# EAGLE schematic can4vscp_eth_rev_A (EAGLE 6.6.0)
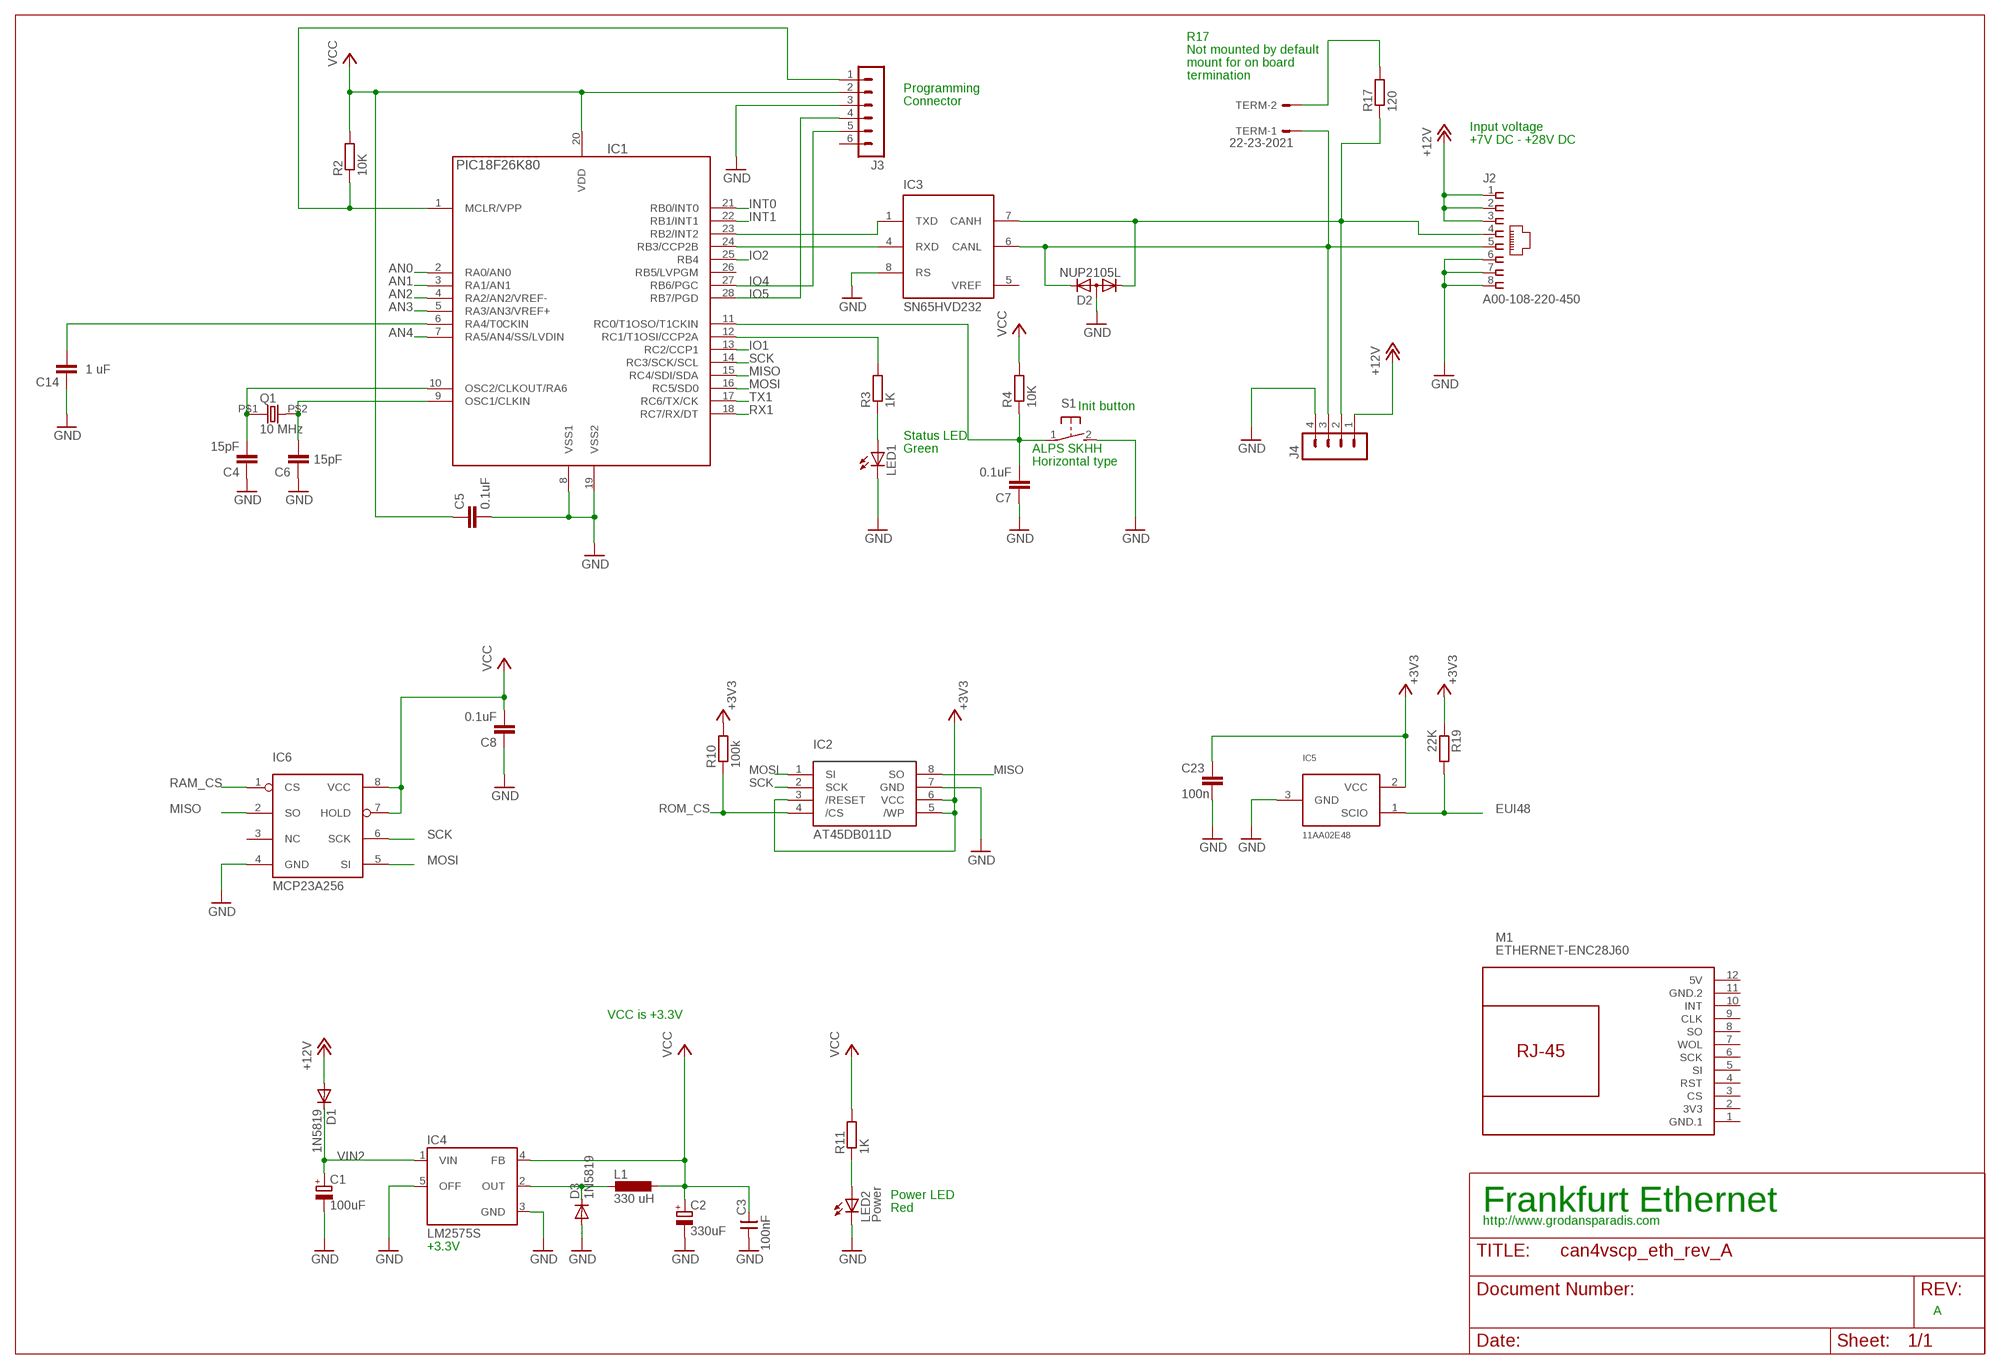
[diagram p0: schematic, sheet 1]

## Parts
C1  100uF  CPOL-EUD  [PANASONIC_D]
C2  330uF  CPOL-EUD  [PANASONIC_D]
C3  100nF  CNP-0805  [0805]
C4  15pF  C-EUC0805  [C0805]
C5  0.1uF  C-EUC0805  [C0805]
C6  15pF  C-EUC0805  [C0805]
C7  0.1uF  C-EUC0805  [C0805]
C8  0.1uF  C-EUC0805  [C0805]
C14  1 uF  C-EUC0805  [C0805]
C23  100n  C-EUC0805  [C0805]
D1  1N5819  DIODE-SOD123  [SOD123]
D2  NUP2105L  DIODE-2CA|ACSOT23  [SOT23]
D3  1N5819  DIODE-SOD123  [SOD123]
IC1  PIC18F26K80  PIC18LF252-I/SO  [SO28]
IC2  AT45DB011D  AT45DB011DSOP8W  [SOP8W]
IC3  SN65HVD232  MCP2551SN  [SO-08]
IC4  LM2575S  [TO263-5]
IC5  11AA02E48  [SOT23]
IC6  MCP23A256  [SO-8]
J2  A00-108-220-450  [RJ-45]
J3  MA06-1  [MA06-1]
J4  MA04-1  [MA04-1]
L1  330 uH  DO3316P  [DO3316P]
LED1  LEDCHIP-LED0805  [CHIP-LED0805]
LED2  Power  LEDCHIP-LED0805  [CHIP-LED0805]
M1  ETHERNET-ENC28J60  [ETHERNET-ENC28J60]
Q1  10 MHz  HC-49S  [9C]
R2  10K  R-EU_R0805  [R0805]
R3  1K  R-EU_R0805  [R0805]
R4  10K  R-EU_R0805  [R0805]
R10  100k  R-EU_M0805  [M0805]
R11  1K  R-EU_R0805  [R0805]
R17  120  R-EU_R0805  [R0805]
R19  22K  R-EU_M0805  [M0805]
S1  31-XX  [B3F-31XX]
TERM  22-23-2021  [22-23-2021]

## Nets
+3V3: C23.1 IC2.3(/RESET) IC2.5(/WP) IC2.6(VCC) IC5.2(VCC) R10.2 R19.1
+12V: D1.A J2.1 J2.2 J2.3 J4.1
AN0: IC1.2(RA0/AN0)
AN1: IC1.3(RA1/AN1)
AN2: IC1.4(RA2/AN2/VREF-)
AN3: IC1.5(RA3/AN3/VREF+)
AN4: IC1.7(RA5/AN4/SS/LVDIN)
CANL: D2.2(K2) IC3.6(CANL) J2.5 J4.3 TERM.1
EUI48: IC5.1(SCIO) R19.2
GND: C1.- C2.- C3.1 C4.1 C5.2 C6.1 C7.1 C8.1 C14.1 C23.2 D2.3(A) D3.A IC1.8(VSS1) IC1.19(VSS2) IC2.7(GND) IC3.8(RS) IC4.3(GND) IC4.5(OFF) IC5.3(GND) IC6.4(GND) J2.6 J2.7 J2.8 J3.3 J4.4 LED1.C LED2.C S1.2(S)
INT0: IC1.21(RB0/INT0)
INT1: IC1.22(RB1/INT1)
IO1: IC1.13(RC2/CCP1)
IO2: IC1.25(RB4)
IO4: IC1.27(RB6/PGC) J3.5
IO5: IC1.28(RB7/PGD) J3.4
MISO: IC1.15(RC4/SDI/SDA) IC2.8(SO) IC6.2(SO)
MOSI: IC1.16(RC5/SD0) IC2.1(SI) IC6.5(SI)
N$1: D3.C IC4.2(OUT) L1.1
N$2: C4.2 IC1.10(OSC2/CLKOUT/RA6) Q1.P$1
N$3: C14.2 IC1.6(RA4/T0CKIN)
N$4: IC1.12(RC1/T1OSI/CCP2A) R3.2
N$5: LED1.A R3.1
N$6: C7.2 IC1.11(RC0/T1OSO/T1CKIN) R4.1 S1.1(P)
N$7: C6.2 IC1.9(OSC1/CLKIN) Q1.P$2
N$11: R17.2 TERM.2
N$20: LED2.A R11.1
N$22: D2.1(K1) IC3.7(CANH) J2.4 J4.2 R17.1
RAM_CS: IC6.1(CS)
RESET: IC1.1(MCLR/VPP) J3.1 R2.1
ROM_CS: IC2.4(/CS) R10.1
RX1: IC1.18(RC7/RX/DT)
RXCAN: IC1.24(RB3/CCP2B) IC3.4(RXD)
SCK: IC1.14(RC3/SCK/SCL) IC2.2(SCK) IC6.6(SCK)
TX1: IC1.17(RC6/TX/CK)
TXCAN: IC1.23(RB2/INT2) IC3.1(TXD)
VCC: C2.+ C3.2 C5.1 C8.2 IC1.20(VDD) IC4.4(FB) IC6.7(HOLD) IC6.8(VCC) J3.2 L1.2 R2.2 R4.2 R11.2
VIN2: C1.+ D1.C IC4.1(VIN)
Unconnected: IC1.26(RB5/LVPGM) IC6.3(NC) J3.6 M1.3(CS) M1.4(RST) M1.5(SI) M1.6(SCK) M1.7(WOL) M1.8(SO) M1.9(CLK) M1.10(INT)

## Notes on the sheet
- R17
- Not mounted by default
- mount for on board
- termination
- Programming
- Connector
- Input voltage
- +7V DC - +28V DC
- Init button
- Status LED
- Green | ALPS SKHH
- Horizontal type
- VCC is +3.3V
- Power LED
- Red | Frankfurt Ethernet
- http://www.grodansparadis.com
- +3.3V
- A

## Power pins joined to a net without a drawn wire
3V3: M1.2(3V3)
5V: M1.12(5V)
GND.1: M1.1(GND.1)
GND.2: M1.11(GND.2)
VDD: IC3.3(VDD)
VREF: IC3.5(VREF)
VSS: IC3.2(VSS)

## Library data of the parts
C1 C2 = rcl:CPOL-EU: POLARIZED CAPACITOR, European symbol
C3 = cap-master:CNP-: NON-POLARIZED CAP
C4-C8 C14 C23 = rcl:C-EU: CAPACITOR, European symbol
D1 D3 = diode:DIODE-: DIODE
D2 = diode:DIODE-2CA|AC: Dual DIODE Cathode-Anode|Anode-Cathode
IC1 = pic_olin:PIC18*F252-?: 18F252, 28 pin, 32Kb prog, 1536 data, 256 EEPROM
IC2 = snow:AT45DB011D
IC3 = microchip_can:MCP2551: High Speed CAN tranceiver
IC4 = v-reg-3:LM2575: National Semiconductor <http://www.national.com> 1.0A "Simple Switcher"(c) 52kHz, Vout 1.23-37V (HV: 57V), Vin 40V (HV: 60V), 50µA standby current
IC5 = snow:11AA02E48
IC6 = vscpcan:MCP23A256
J2 = vscpcan:A00-108-220-450
J3 = con-lstb:MA06-1: PIN HEADER; OC_FARNELL: unknown; OC_NEWARK: unknown
J4 = con-lstb:MA04-1: PIN HEADER; OC_FARNELL: unknown; OC_NEWARK: unknown
L1 = inductor-coilcraft:DO3316P: COILCRAFT; OC_FARNELL: unknown; OC_NEWARK: unknown
LED1 LED2 = led:LED: LED OSRAM: - CHIPLED LG R971, LG N971, LY N971, LG Q971, LY Q971, LO R971, LY R971 LH N974, LH R974 LS Q976, LO Q976, LY Q976 LO Q996 - Hyper CHIPLED LW Q18S LB Q993, LB Q99A, LB R99A - SideLED LS A670, LO A670, LY A670, LG A670, LP A670 LB A673, LV A673, LT A673, LW A673 LH A674 LY A675 LS A676, LA A676, LO A676, LY A676, LW A676 LS A679, LY A679, LG A679 - Hyper Micro SIDELED® LS Y876, LA Y876, LO Y876, LY Y876 LT Y87S - SmartLED LW L88C, LW L88S LB L89C, LB L89S, LG L890 LS L89K, LO L89K, LY L89K LS L896, LA L896, LO L896, LY L896 - TOPLED LS T670, LO T670, LY T670, LG T670, LP T670 LSG T670, LSP T670, LSY T670, LOP T670, LYG T670 LG T671, LOG T671, LSG T671 LB T673, LV T673, LT T673, LW T673 LH T674 LS T676, LA T676, LO T676, LY T676, LB T676, LH T676, LSB T676, LW T676 LB T67C, LV T67C, LT T67C, LS T67K, LO T67K, LY T67K, LW E67C LS E67B, LA E67B, LO E67B, LY E67B, LB E67C, LV E67C, LT E67C LW T67C LS T679, LY T679, LG T679 LS T770, LO T770, LY T770, LG T770, LP T770 LB T773, LV T773, LT T773, LW T773 LH T774 LS E675, LA E675, LY E675, LS T675 LS T776, LA T776, LO T776, LY T776, LB T776 LHGB T686 LT T68C, LB T68C - Hyper Mini TOPLED® LB M676 - Mini TOPLED Santana® LG M470 LS M47K, LO M47K, LY M47K Source: http://www.osram.convergy.de LUXEON: - LUMILED® LXK2-PW12-R00, LXK2-PW12-S00, LXK2-PW14-U00, LXK2-PW14-V00 LXK2-PM12-R00, LXK2-PM12-S00, LXK2-PM14-U00 LXK2-PE12-Q00, LXK2-PE12-R00, LXK2-PE12-S00, LXK2-PE14-T00, LXK2-PE14-U00 LXK2-PB12-K00, LXK2-PB12-L00, LXK2-PB12-M00, LXK2-PB14-N00, LXK2-PB14-P00, LXK2-PB14-Q00 LXK2-PR12-L00, LXK2-PR12-M00, LXK2-PR14-Q00, LXK2-PR14-R00 LXK2-PD12-Q00, LXK2-PD12-R00, LXK2-PD12-S00 LXK2-PH12-R00, LXK2-PH12-S00 LXK2-PL12-P00, LXK2-PL12-Q00, LXK2-PL12-R00 Source: www.luxeon.com KINGBRIGHT: KA-3528ASYC Source: www.kingbright.com
M1 = diy-modules:ETHERNET-ENC28J60: Ethernet Module based on ENC28J60 chip
Q1 = vscpcan:HC-49S: Digikey 887-1050-1-nd
R2-R4 R10 R11 R17 R19 = rcl:R-EU_: RESISTOR, European symbol
S1 = switch-omron:31-XX: OMRON SWITCH; MPN: B3F-3100; OC_FARNELL: 959704; OC_NEWARK: 36M3582
TERM = con-molex:22-23-2021: .100" (2.54mm) Center Header - 2 Pin; MF: MOLEX; MPN: 22-23-2021; OC_FARNELL: 1462926; OC_NEWARK: 25C3832